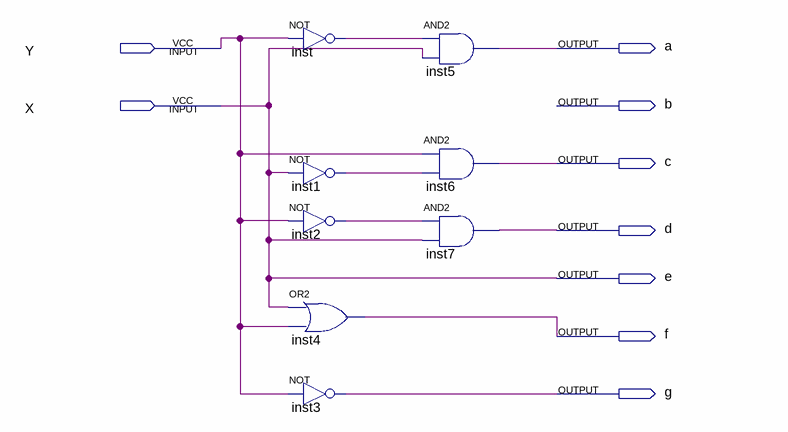
[diagram p0: schematic sheet]
// Quartus schematic 7SegDecoder.bdf as structural Verilog: 8 symbols, 9 pins
module \7SegDecoder  (
  input  Y,
  input  X,
  output a,
  output b,
  output c,
  output d,
  output e,
  output f,
  output g
);

  wire inst1_out, inst2_out, inst_out;

  not inst (inst_out, Y);
  not inst1 (inst1_out, X);
  not inst2 (inst2_out, Y);
  or inst4 (f, X, Y);
  not inst3 (g, Y);
  and inst5 (a, inst_out, X);
  and inst6 (c, Y, inst1_out);
  and inst7 (d, inst2_out, X);

  assign e = X;
endmodule
